# Altium schematic sheet Microcontroller_SCH.SchDoc
size A3; SheetNumber: 3; SheetTotal: 6
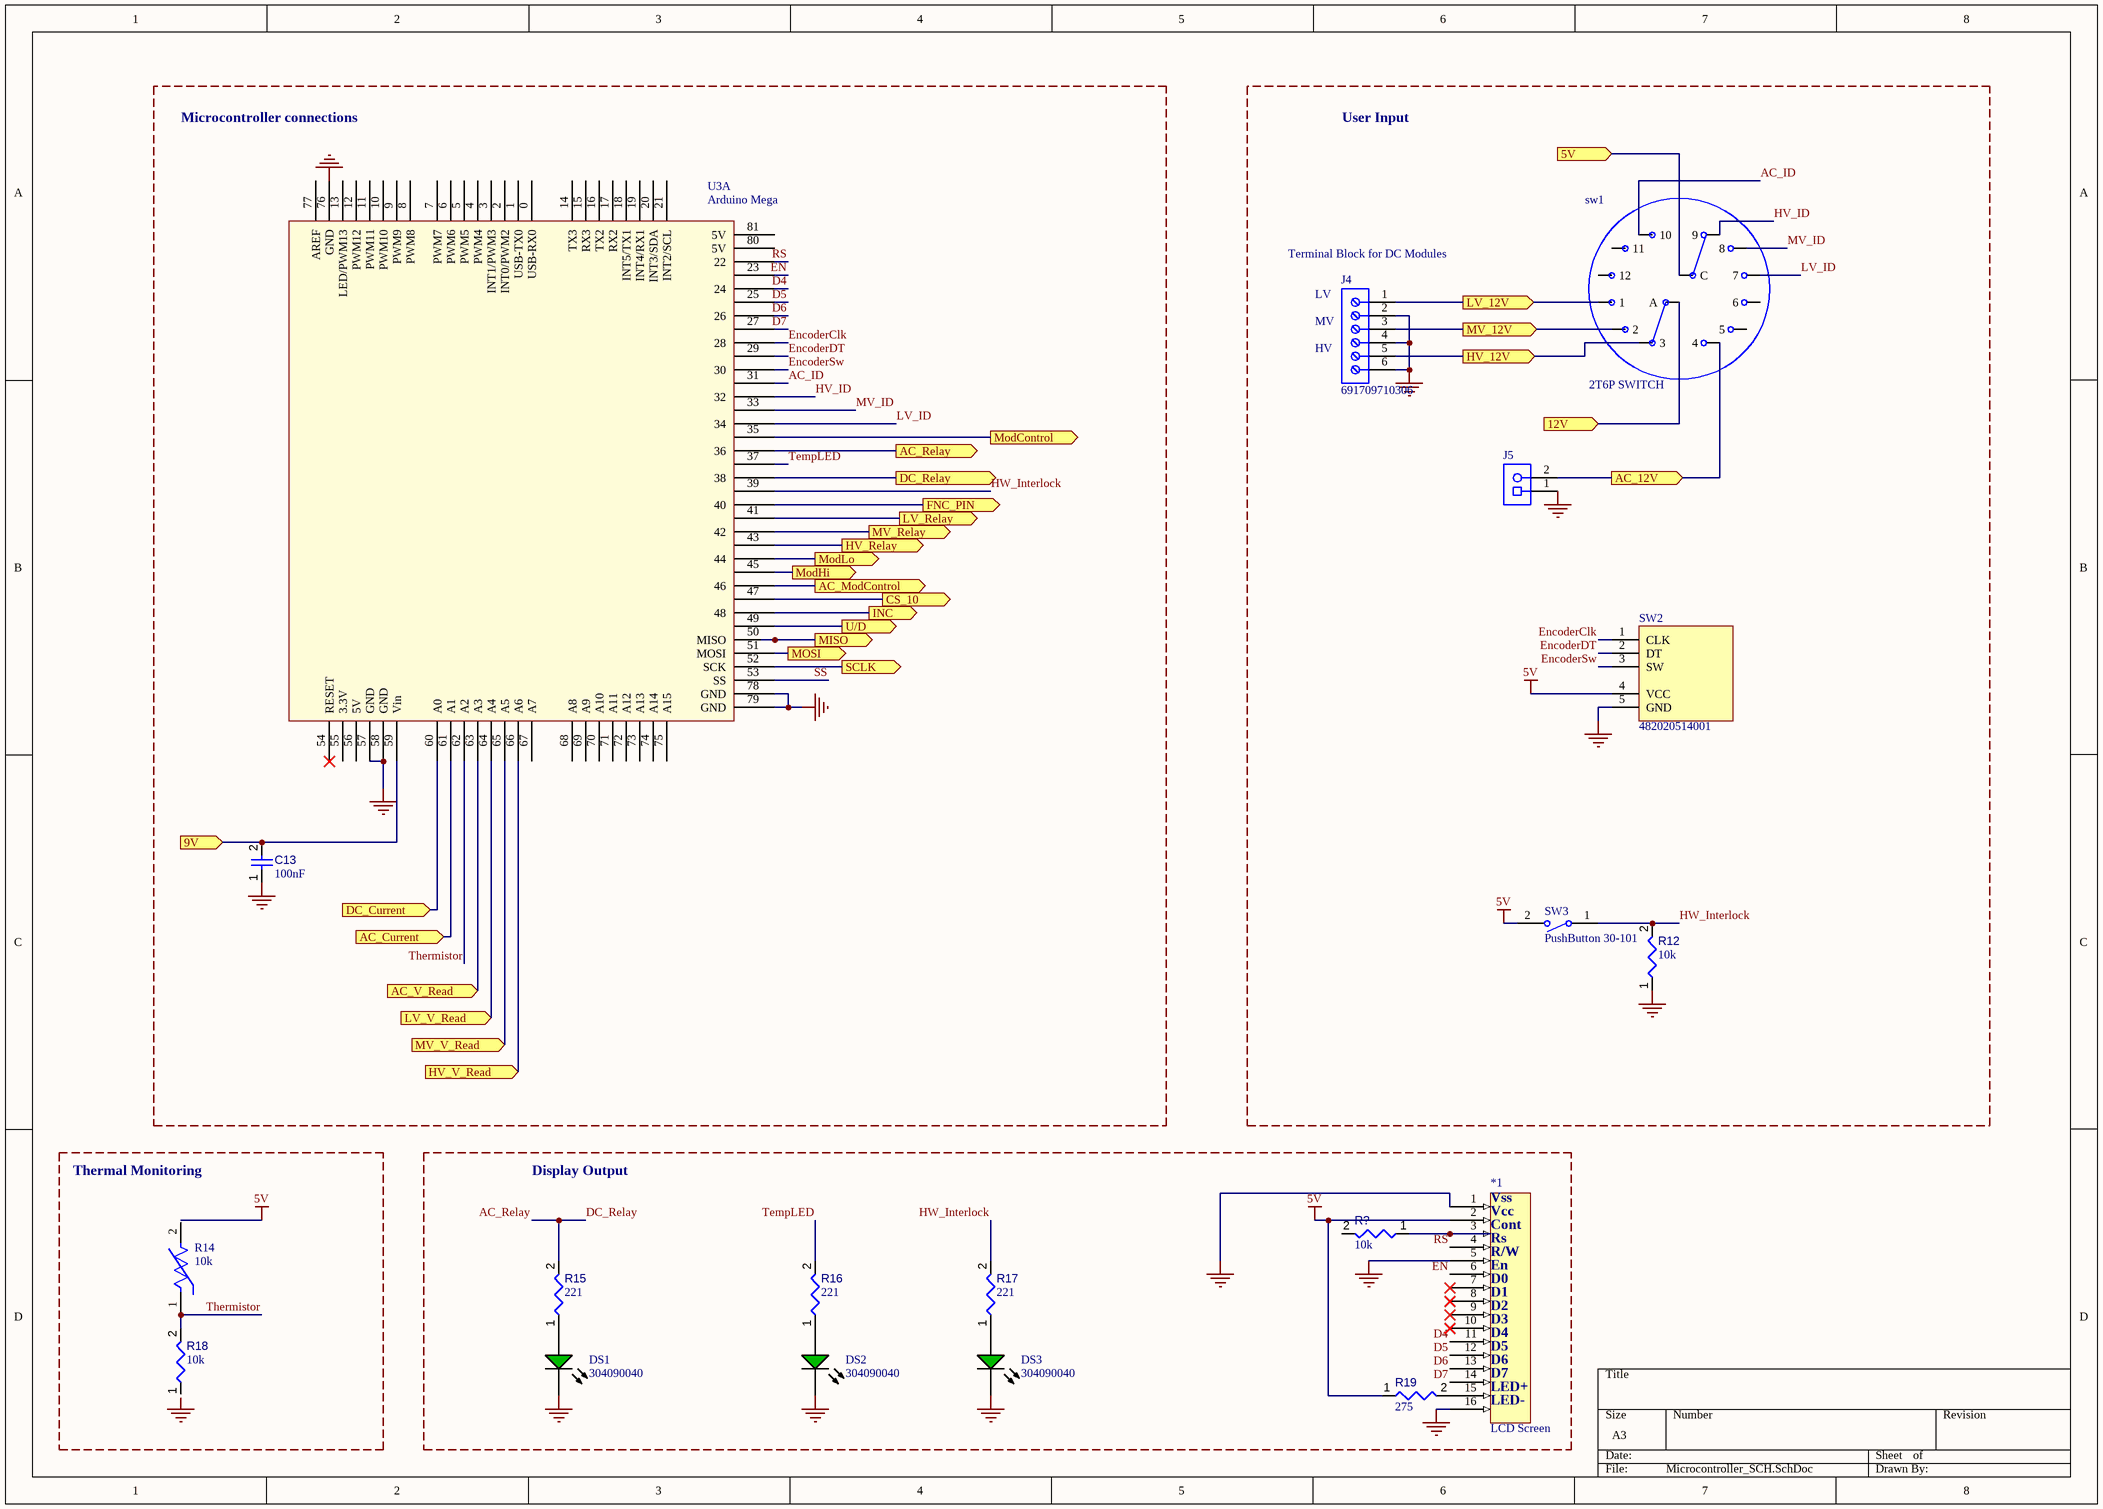
[diagram p0: Microcontroller_SCH.SchDoc]

## Parts
*1  LCD Screen  [LCD Screen-Footprint-1]
C13  value 100nF  [CAPC1210(3225)170_L]  (hidden comment: C1210C104J1RACTU)
DS1  304090040  [LED-2P-2.28-3MM]
DS2  304090040  [LED-2P-2.28-3MM]
DS3  304090040  [LED-2P-2.28-3MM]
J4  691709710306  [691709710306]
J5  1729128  [PHOE-1729128-2_V]  (value not drawn)
R12  value 10k  [RESA60-630X240]  (hidden comment: MFR-25FBF52-10K)
R14  value 10k  [FP-NTCLE305E4103SB-MFG]  (hidden comment: NTCLE305E4103SB)
R15  value 221  [RESA60-630X240]  (hidden comment: MFR-25FBF52-221R)
R16  value 221  [RESA60-630X240]  (hidden comment: MFR-25FBF52-221R)
R17  value 221  [RESA60-630X240]  (hidden comment: MFR-25FBF52-221R)
R18  value 10k  [FP-MF0207-MFG]  (hidden comment: MF0207FTE52-10K)
R19  value 275  [1-1879643-4-Footprint-1]  (hidden comment: 1-1879643-4)
R?  value 10k  [RESA60-630X240]  (hidden comment: MFR-25FBF52-10K)
sw1  2T6P SWITCH  [2T6P]
SW2  482020514001  [4820xx514001]
SW3  PushButton 30-101  [FP-30-101-MFG]
U3  Arduino Mega  [s]  (part A of 3)

## Blocks framed on the sheet
Microcontroller connections: C13 U3
User Input: J4 J5 R12 sw1 SW2 SW3
Thermal Monitoring: R14 R18
Display Output: *1 DS1-DS3 R15-R17 R19 R?

## Ports
5V (in), 9V (in), 12V (in), AC_12V (out), AC_Current (in), AC_ModControl (out), AC_Relay (out), AC_V_Read (in), CS_10 (out), DC_Current (in), DC_Relay (out), FNC_PIN (out), HV_12V (out), HV_Relay (out), HV_V_Read (in), INC (out), LV_12V (out), LV_Relay (out), LV_V_Read (in), MISO (out), ModControl (out), ModHi (out), ModLo (out), MOSI (out), MV_12V (out), MV_Relay (out), MV_V_Read (in), SCLK (out), U/D (out)

## Nets
5V: *1.2 R14.2 R19.1 SW2.4(VCC) SW3.2
GND: *1.1 *1.5 *1.16 C13.1 DS1.2(K) DS2.2(K) DS3.2(K) J4.2 J4.4 J4.6 J5.1 R12.1 R18.1 SW2.5(GND) U3.57(GND) U3.58(GND) U3.76(GND)
ND: U3.78(GND) U3.79(GND)
5V: sw1.C ; port 5V  [a separate net that carries the same name]
9V: C13.2 U3.59(Vin) ; port 9V
12V: sw1.A ; port 12V
AC_12V: J5.2 sw1.4 ; port AC_12V
AC_Current: U3.61(A1) ; port AC_Current
AC_ID: sw1.10 U3.31
AC_ModControl: U3.46 ; port AC_ModControl
AC_Relay: U3.36 ; port AC_Relay
AC_Relay: R15.2  [also labelled DC_Relay]  [a separate net that carries the same name]
AC_V_Read: U3.63(A3) ; port AC_V_Read
CS_10: U3.47 ; port CS_10
D4: *1.11 U3.24
D5: *1.12 U3.25
D6: *1.13 U3.26
D7: *1.14 U3.27
DC_Current: U3.60(A0) ; port DC_Current
DC_Relay: U3.38 ; port DC_Relay
EN: *1.6 U3.23
EncoderClk: SW2.1(CLK) U3.28
EncoderDT: SW2.2(DT) U3.29
EncoderSw: SW2.3(SW) U3.30
FNC_PIN: U3.40 ; port FNC_PIN
HV_12V: J4.5 sw1.3 ; port HV_12V
HV_ID: sw1.9 U3.32
HV_Relay: U3.43 ; port HV_Relay
HV_V_Read: U3.66(A6) ; port HV_V_Read
HW_Interlock: R12.2 R17.2 SW3.1 U3.39
INC: U3.48 ; port INC
LV_12V: J4.1 sw1.1 ; port LV_12V
LV_ID: sw1.7 U3.34
LV_Relay: U3.41 ; port LV_Relay
LV_V_Read: U3.64(A4) ; port LV_V_Read
MISO: U3.50(MISO) ; port MISO
ModControl: U3.35 ; port ModControl
ModHi: U3.45 ; port ModHi
ModLo: U3.44 ; port ModLo
MOSI: U3.51(MOSI) ; port MOSI
MV_12V: J4.3 sw1.2 ; port MV_12V
MV_ID: sw1.8 U3.33
MV_Relay: U3.42 ; port MV_Relay
MV_V_Read: U3.65(A5) ; port MV_V_Read
RS: *1.4 U3.22
SCLK: U3.52(SCK) ; port SCLK
SS: U3.53(SS)
TempLED: R16.2 U3.37
Thermistor: R14.1 R18.2 U3.62(A2)
U/D: U3.49 ; port U/D
Net*1_3: *1.3 R?.1
Net*1_15: *1.15 R19.2
NetDS1_1: DS1.1(A) R15.1
NetDS2_1: DS2.1(A) R16.1
NetDS3_1: DS3.1(A) R17.1

Not connected (* = marked no-connect by the designer): *1 7* 8* 9* 10*; R? 2; sw1 5 6 11 12; U3 0(USB-RX0) 1(USB-TX0) 2(INT0/PWM2) 3(INT1/PWM3) 4(PWM4) 5(PWM5) 6(PWM6) 7(PWM7) 8(PWM8) 9(PWM9) 10(PWM10) 11(PWM11) 12(PWM12) 13(LED/PWM13) 14(TX3) 15(RX3) 16(TX2) 17(RX2) 18(INT5/TX1) 19(INT4/RX1) 20(INT3/SDA) 21(INT2/SCL) 54(RESET)* 55(3.3V) 56(5V) 67(A7) 68(A8) 69(A9) 70(A10) 71(A11) 72(A12) 73(A13) 74(A14) 75(A15) 77(AREF) 80(5V) 81(5V)

## Notes on the sheet
- (near J4) Terminal Block for DC Modules
- (near J4) LV
- (near J4) HV
- (near J4) MV
- (in symbol CMP-015-00010-4) Vss; Vcc; Cont; Rs; R/W; En; D0; D1; D2; D3; D4; D5; D6; D7; LED+; LED-

## Library data of the parts
*1 = CMP-015-00010-4: 20x4 LCD screen with 16 pin input
C13 = CMP-001-00090-1: Ceramic Capacitor, Multilayer, Ceramic, 100V, 5% +Tol, 5% -Tol, X7R, 15% TC, 0.1uF, Surface Mount, 1210; Min Operating Temperature: -55°C; Case/Package: 1210; Max Operating Temperature: 125°C; RoHS Compliant: Yes; Pins: 2; Capacitor Type: Ceramic; Mounting Technology: Surface Mount
DS1-DS3 = CMP-007-00006-2: Green LED, 80 mW, 20 mA, -25 to 85 degC, 2-Pin THD; Manufacturer: Shenzhen CGX; Manufacturer URL: http://szcgx.com/; Package Reference: 304090040; Datasheet Version: Rev. 1.0, 09/2014; RoHS Compliant: Unknown; Case/Package: 304090040; Package Description: 2-Pin Through Hole Device, Dia 3 mm, Pitch 2.28 mm; Datasheet URL: http://datasheet.octopart.com/304090040-Chengguangxing-datasheet-62330655.pdf; Mounting Technology: TH
J4 = CMP-002-00073-2: WR-TBL Terminal block - Rising Cage - SMT 6 way screw
J5 = CMP-002-00077-1: Barrier Strip Terminal Block, 13.5A, 1.5mm2, 1 Row(s), 1 Deck(s); Voltage Rating: 400V; RoHS Compliant: Yes; Mounting Technology: Board
R12 R? = CMP-009-00047-4: Axial Resistor, 10 KOhm, +/- 1%, 0.25 W, -55 to 155 degC, 2-Pin THD, RoHS, Bulk; Manufacturer: Yageo; Power: 250mW; Voltage Rating: 250V; Manufacturer URL: http://www.yageo.com/; Datasheet URL: http://www.yageo.com/documents/recent/Yageo%20LR_MFR_2013.pdf; Package Reference: MFR-25; Min Operating Temperature: -55°C; Mounting Technology: TH; Package Quantity: 200; Case/Package: Axial; Tolerance: 1%; RoHS Compliant: True; Datasheet Version: Apr-13; Packaging: Bulk; Max Operating Temperature: 155°C; Package Description: 2-Pin Axial Lead, Dia 2.4 mm, Body Length 6.3 mm
R14 = CMP-009-00180-1: Thermistor NTC 10K Ohm 2.2% 2-Pin Wire 3984K -4.5 to -4 Cardboard Box; Max Operating Temperature: 125°C; Mounting Technology: Through Hole; Case/Package: Radial; Min Operating Temperature: -40°C; Tolerance: 2.2%; Pins: 2; RoHS Compliant: Yes
R15-R17 = CMP-009-00051-4: Axial Resistor, 221 Ohm, +/- 1%, 250 mW, -55 to 155 degC, 2-Pin THD, RoHS, Bulk; Manufacturer: Yageo; Power: 250mW; Voltage Rating: 250V; Package Quantity: 200; Manufacturer URL: http://www.yageo.com/; Case/Package: Axial; Package Reference: MFR-25; RoHS Compliant: True; Mounting Technology: TH; Datasheet URL: http://www.yageo.com/documents/recent/Yageo%20LR_MFR_2013.pdf; Packaging: Bulk; Package Description: 2-Pin Axial Lead, Dia 2.4 mm, Body Length 6.3 mm; Max Operating Temperature: 155°C; Tolerance: 1%; Datasheet Version: Apr-13; Min Operating Temperature: -55°C
R18 = CMP-009-00178-1: Fixed Resistor, Metal Film, 0.6W, 10000ohm, 350V, 1% +/-Tol, 50ppm/Cel, Through Hole Mount; Mounting Technology: Through Hole; Min Operating Temperature: -55°C; Tolerance: 1%; Case/Package: Axial; Max Operating Temperature: 155°C; RoHS Compliant: Yes
R19 = CMP-009-00184-1: Fixed Resistor, Thin Film, 0.25W, 275ohm, 350V, 0.5% +/-Tol, 50ppm/Cel, Through Hole Mount; Power: 250mW; RoHS Compliant: Yes; Mounting Technology: Through Hole; Pins: 2; Tolerance: 0.5%
sw1 = CMP-011-00015-5: 2 pole/throw 6 position switch, S3022 Altronics
SW2 = CMP-00030-00001-1: Rotary Position Encoder- bad pinout; RoHS Compliant: Yes
SW3 = CMP-011-00013-2: Pushbutton Switch, SPST, Momentary, 0.15A, 24VDC, Solder Terminal, Panel Mount; Max Operating Temperature: 80°C; Mounting Technology: Panel; Min Operating Temperature: -40°C; RoHS Compliant: Yes
U3 = CMP-020-00024-1: Adruino Mega MCU